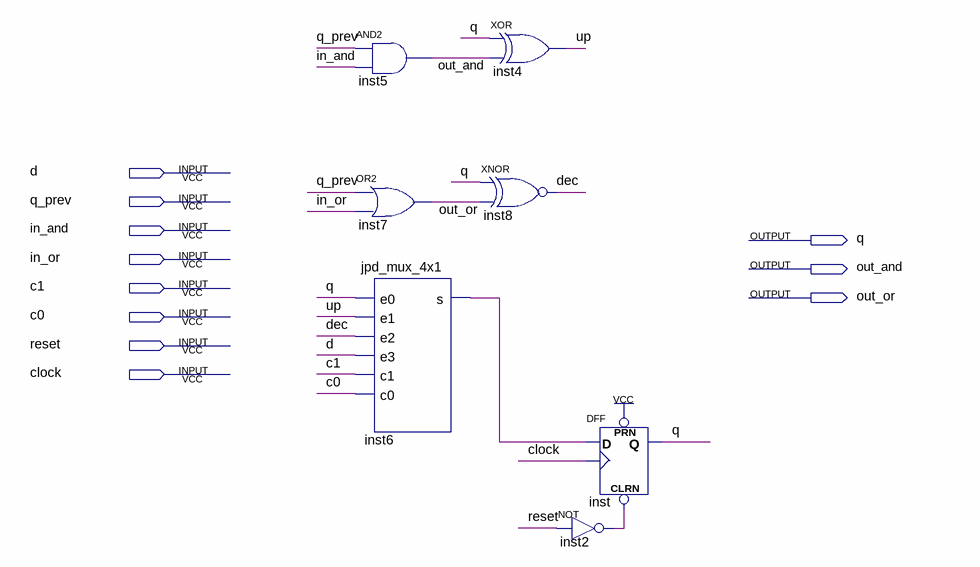
[diagram p0: schematic sheet]
// Quartus schematic jpd_generic_counter.bdf as structural Verilog: 7 symbols, 11 pins
module jpd_generic_counter (
  input  d,
  input  q_prev,
  input  in_and,
  input  in_or,
  input  c1,
  input  c0,
  input  reset,
  input  clock,
  output q,
  output out_and,
  output out_or
);

  wire dec, inst2_out, inst6_s, up;

  and inst5 (out_and, q_prev, in_and);
  or inst7 (out_or, q_prev, in_or);
  jpd_mux_4x1 inst6 (.e0(q), .e1(up), .e2(dec), .e3(d), .c1(c1), .c0(c0), .s(inst6_s));
  xor inst4 (up, q, out_and);
  xnor inst8 (dec, q, out_or);
  DFF inst (.CLRN(inst2_out), .CLK(clock), .D(inst6_s), .PRN(1'b1), .Q(q));
  not inst2 (inst2_out, reset);
endmodule
